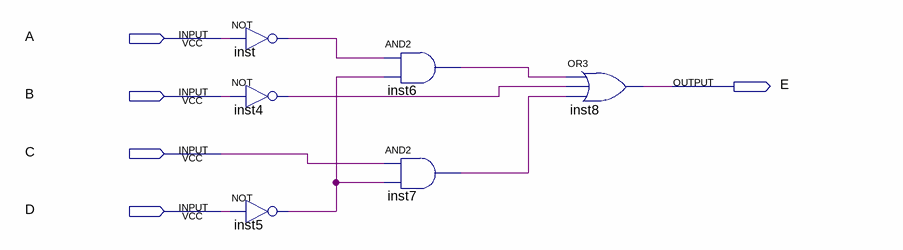
[diagram p0: schematic sheet]
// Quartus schematic Halfadd.bdf as structural Verilog: 6 symbols, 5 pins
module Halfadd (
  input  A,
  input  B,
  input  C,
  input  D,
  output E
);

  wire inst4_out, inst5_out, inst6_out, inst7_out, inst_out;

  not inst (inst_out, A);
  not inst4 (inst4_out, B);
  not inst5 (inst5_out, D);
  and inst6 (inst6_out, inst_out, inst5_out);
  and inst7 (inst7_out, C, inst5_out);
  or inst8 (E, inst6_out, inst4_out, inst7_out);
endmodule
